# Altium project encoder.PrjPCB
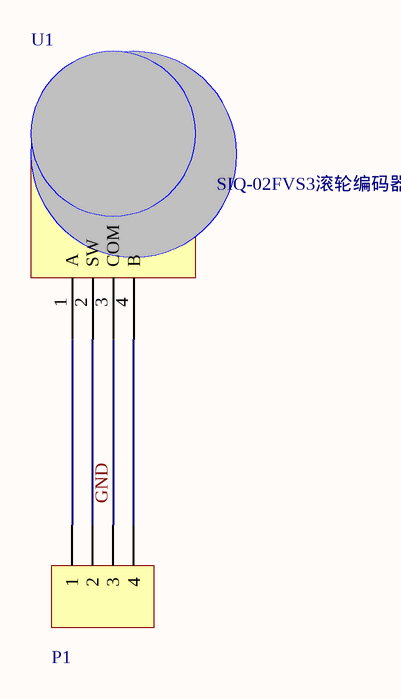
[diagram p0: encoder.SchDoc]
1 sheet, 2 parts. Net scope: global (net labels, ports and power ports of the same name join across sheets).
Board file: encoder.PcbDoc

## Sheet encoder.SchDoc
size A2

### Parts
P1  (no value)  [MX1.25-4P 卧]
U1  SIQ-02FVS3滚轮编码器  [美上美SIQ-02FVS3滚轮编码器]

### Nets
GND: P1.3 U1.3(COM)
NetP1_1: P1.1 U1.1(A)
NetP1_2: P1.2 U1.2(SW)
NetP1_4: P1.4 U1.4(B)

### Library data of the parts
P1 = Header 4: Header, 4-Pin; LatestRevisionDate: 17-Jul-2002; LatestRevisionNote: Re-released for DXP Platform.; Publisher: Altium Limited